# EAGLE design It-s Time, Do (EAGLE 9.6.2)
AUTHOR: Tiago Silva; IGNORE_RENUMBER: TP; SOURCE: github.com/TiagoPaulaSilva/It-s-Time-Do; VERSION: 1.1
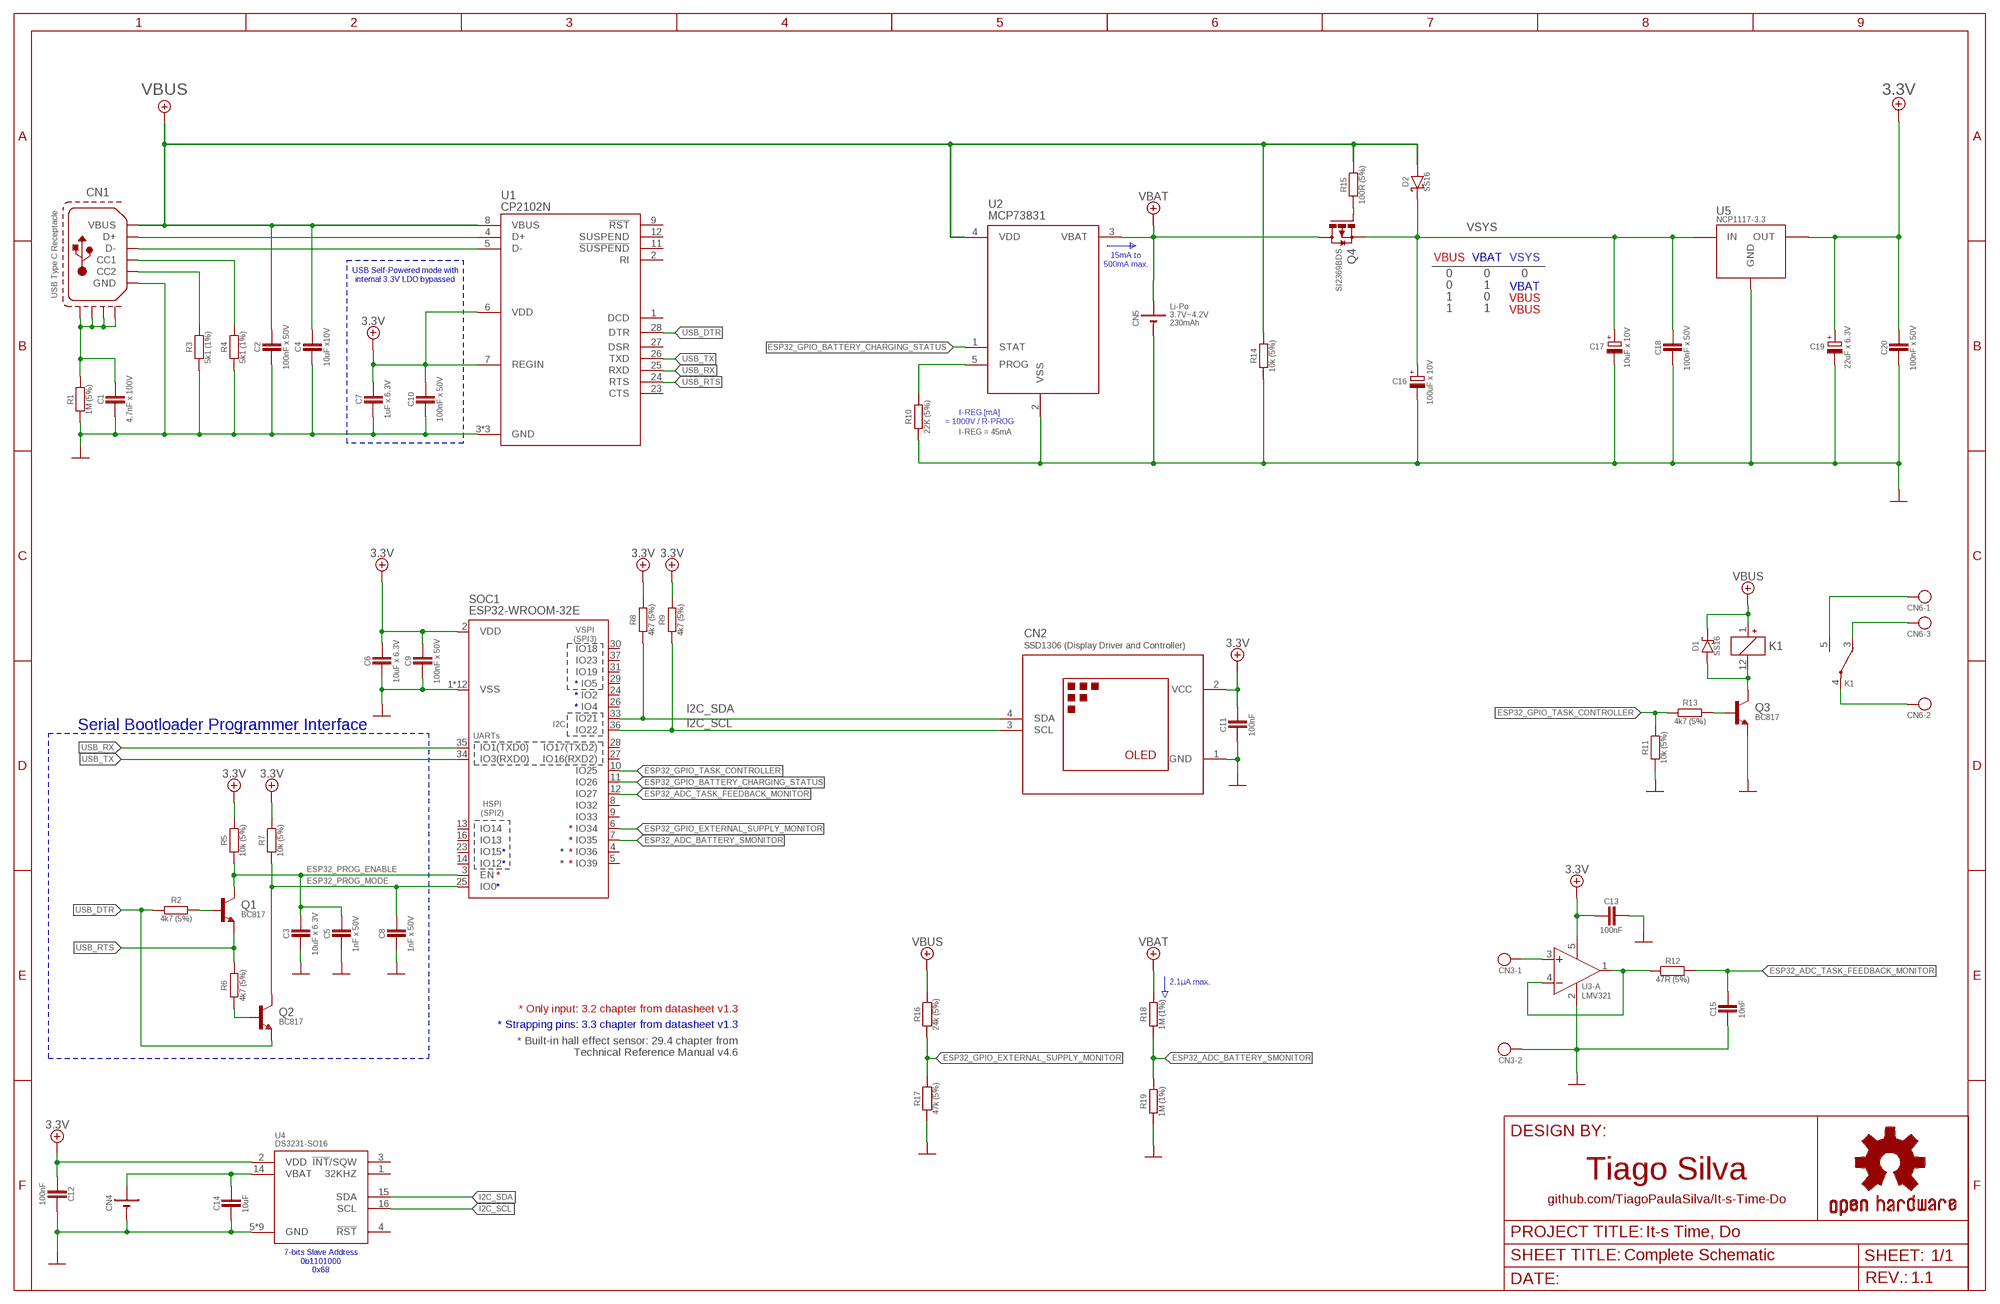
[diagram p0: schematic, sheet 1]

## Parts
C1  4.7nF x 100V  C_0603  [C0603]
C2  100nF x 50V  C_0603  [C0603]
C3  10uF x 6.3V  C_0603  [C0603]
C4  10uF x10V  C_0603  [C0603]
C5  1nF x 50V  C_0603  [C0603]
C6  10uF x 6.3V  C_0603  [C0603]
C7  1uF x 6.3V  C_0603  [C0603]
C8  1nF x 50V  C_0603  [C0603]
C9  100nF x 50V  C_0603  [C0603]
C10  100nF x 50V  C_0603  [C0603]
C11  100nF  C_0603  [C0603]
C12  100nF  C_0603  [C0603]
C13  100nF  C_0603  [C0603]
C14  10uF  C_0603  [C0603]
C15  10nF  C_0603  [C0603]
C16  100uF x 10V  CP_5MM  [PTH-5MM]
C17  10uF x 10V  CP_1206_POL  [C1206_POL]
C18  100nF x 50V  C_0603  [C0603]
C19  22uF x 6.3V  CP_1206_POL  [C1206_POL]
C20  100nF x 50V  C_0603  [C0603]
CN1  USB Type C Receptacle  USB-C-16P-2LAYERS  [USB-C-16P-2LAYER-PADS]
CN2  OLED-MODULE-I2C-SOCKET  [PIN_HEADER_1X4_FEMALE]
CN3  2P-MINI-FIT-JR  [MINI-FIT-JR-2P]
CN4  CR1220  CELL-HARWIN  [CR1220/1225_HOLDER2]
CN5  BATTERY  CELL-JST-PH-2P-H  [JST-PH-2P-H]
CN6  3P-MINI-FIT-JR  [MINI-FIT-JR-3P]
D1  FM4004  SCHOTTKY-SS16  [DO-214AC]
D2  SCHOTTKY-SS16  [DO-214AC]
K1  DPDT-SMD  [EE2-5NU]
Q1  NPN-BC817  [SOT23-3]
Q2  NPN-BC817  [SOT23-3]
Q3  BC817  NPN-BC817  [SOT23-3]
Q4  P-FET-ENHANCEMENT-SI2369BDS  [SOT23-3]
R1  1M (5%)  R_0603  [R0603]
R2  4k7 (5%)  R_0603  [R0603]
R3  5k1 (1%)  R_0603  [R0603]
R4  5k1 (1%)  R_0603  [R0603]
R5  10k (5%)  R_0603  [R0603]
R6  4k7 (5%)  R_0603  [R0603]
R7  10k (5%)  R_0603  [R0603]
R8  4k7 (5%)  R_0603  [R0603]
R9  4k7 (5%)  R_0603  [R0603]
R10  22K (5%)  R_0603  [R0603]
R11  10k (5%)  R_0603  [R0603]
R12  47R (5%)  R_0603  [R0603]
R13  4k7 (5%)  R_0603  [R0603]
R14  10k (5%)  R_0603  [R0603]
R15  100R (5%)  R_0603  [R0603]
R16  24k (5%)  R_0603  [R0603]
R17  47k (5%)  R_0603  [R0603]
R18  1M (1%)  R_0603  [R0603]
R19  1M (1%)  R_0603  [R0603]
SOC1  ESP32-WROOM-32E  ESP32-WROOM-32E-N4  [ESP32-WROOM-32E]
U1  CP2102N  [QFN-28]
U2  MCP73831  MCP73831T-2ACI/OT  [SOT-23-5]
U3  LMV321  SINGLE-LMV321  [SOT-23-5]
U4  DS3231-SO16  [SOIC-16W_(SO16)]
U5  1117-3.3V  [SOT-223-3]

## Nets
0V: C1.1 C2.1 C3.2 C4.1 C5.2 C6.2 C7.1 C8.2 C9.2 C10.1 C11.2 C12.1 C13.1 C14.2 C15.2 C16.2(-) C17.2(-) C18.2 C19.2(-) C20.2 CN1.GND CN1.GND2(GND) CN2.1(GND) CN3.2 CN4.2(-) CN5.2(-) Q3.2(E) R1.2 R3.2 R4.2 R10.1 R11.2 R14.1 R17.2 R19.1 SOC1.1(VSS) SOC1.15(VSS) SOC1.38(VSS) SOC1.E1(VSS) SOC1.E2(VSS) SOC1.E3(VSS) SOC1.E4(VSS) SOC1.E5(VSS) SOC1.E6(VSS) SOC1.E7(VSS) SOC1.E8(VSS) SOC1.E9(VSS) U1.3(GND) U1.EXP(GND) U1.M(GND) U2.2(VSS) U3.2(V-) U4.5(GND) U4.6(GND) U4.7(GND) U4.8(GND) U4.9(GND) U4.10(GND) U4.11(GND) U4.12(GND) U4.13(GND) U5.1(GND)
3.3V: C6.1 C7.2 C9.1 C10.2 C11.1 C12.2 C13.2 C19.1(+) C20.1 CN2.2(VCC) R5.1 R7.1 R8.2 R9.2 SOC1.2(VDD) U1.6(VDD) U1.7(REGIN) U3.5(V+) U4.2(VDD) U5.2(OUT) U5.4(OUT)
ESP32_ADC_BATTERY_SMONITOR: R18.1 R19.2 SOC1.7(IO35)
ESP32_ADC_TASK_FEEDBACK_MONITOR: C15.1 R12.2 SOC1.12(IO27)
ESP32_GPIO_BATTERY_CHARGING_STATUS: SOC1.11(IO26) U2.1(STAT)
ESP32_GPIO_EXTERNAL_SUPPLY_MONITOR: R16.2 R17.1 SOC1.6(IO34)
ESP32_GPIO_TASK_CONTROLLER: R11.1 R13.2 SOC1.10(IO25)
ESP32_PROG_ENABLE: C3.1 C5.1 Q1.3(C) R5.2 SOC1.3(EN)
ESP32_PROG_MODE: C8.1 Q2.3(C) R7.2 SOC1.25(IO0)
I2C_SCL: CN2.3(SCL) R9.1 SOC1.36(IO22) U4.16(SCL)
I2C_SDA: CN2.4(SDA) R8.1 SOC1.33(IO21) U4.15(SDA)
N$1: CN1.B5(CC2) R3.1
N$2: CN1.A5(CC1) R4.1
N$3: CN1.A7(D-) CN1.B7(D-) U1.5(D-)
N$4: CN3.1 U3.3(-A:+IN)
N$5: CN6.1 K1.5(-A:NO)
N$6: CN1.A6(D+) CN1.B6(D+) U1.4(D+)
N$7: Q1.1(B) R2.1
N$8: Q2.1(B) R6.1
N$11: Q4.1(G) R15.2
N$12: R12.1 U3.1(-A:OUT) U3.4(-A:-IN)
N$14: CN6.2 K1.4(-A:COM)
N$15: CN6.3 K1.3(-A:NC)
N$26: R10.2 U2.5(PROG)
N$41: Q3.1(B) R13.1
N$42: D1.2(A) K1.12(K:-) Q3.3(C)
N$79: C1.2 CN1.SHLD1(S1) CN1.SHLD2(S2) CN1.SHLD3(S3) CN1.SHLD4(S4) R1.1
P$1: CN5.1(+) Q4.3(D) R18.2 U2.3(VBAT) ; supply symbol labelled VBAT
RTC_VBAT: C14.1 CN4.1(+) U4.14(VBAT)
USB_DTR: Q2.2(E) R2.2 U1.28(DTR)
USB_RTS: Q1.2(E) R6.2 U1.24(RTS)
USB_RX: SOC1.35(IO1(TXD0)) U1.25(RXD)
USB_TX: SOC1.34(IO3(RXD0)) U1.26(TXD)
VBUS: C2.2 C4.2 CN1.VBUS1(VBUS) CN1.VBUS2(VBUS) D1.1(K) D2.2(A) K1.1(K:+) R14.2 R15.1 R16.1 U1.8(VBUS) U2.4(VDD)
VSYS: C16.1(+) C17.1(+) C18.1 D2.1(K) Q4.2(S) U5.3(IN)
Unconnected: K1.8(-B:NO) K1.9(-B:COM) K1.10(-B:NC) SOC1.4(IO36) SOC1.5(IO39) SOC1.8(IO32) SOC1.9(IO33) SOC1.13(IO14) SOC1.14(IO12) SOC1.16(IO13) SOC1.23(IO15) SOC1.24(IO2) SOC1.26(IO4) SOC1.27(IO16(RXD2)) SOC1.28(IO17(TXD2)) SOC1.29(IO5) SOC1.30(IO18) SOC1.31(IO19) SOC1.37(IO23) U1.1(DCD) U1.2(RI) U1.9(!RST) U1.11(!SUSPEND) U1.12(SUSPEND) U1.23(CTS) U1.27(DSR) U4.1(32KHZ) U4.3(!INT!/SQW) U4.4(!RST!)

## Notes on the sheet
- VBUS | VBAT | VSYS
- 15mA to
  500mA max.
- 0 | 0 | 0
- USB Self-Powered mode with
  internal 3.3V LDO bypassed
- 0 | 1 | VBAT
- 1 | 0 | VBUS
- 1 | 1 | VBUS
- I-REG [mA]
  = 1000V / R-PROG
- I-REG = 45mA
- VSPI
  (SPI3)
- *
- *
- *
- Serial Bootloader Programmer Interface | I2C
- UARTs
- HSPI
  (SPI2)
- *
- *
- * | * | *
- * | * | *
- *
- *
- 2.1μA max.
- * Only input: 3.2 chapter from datasheet v1.3
- * Strapping pins: 3.3 chapter from datasheet v1.3
- * Built-in hall effect sensor: 29.4 chapter from
  Technical Reference Manual v4.6
- 7-bits Slave Address
  0b1101000
  0x68

## Library data of the parts
C1-C10 C15 C18 C20 = My-RLC:C_: NON-POLARIZED CAP
C11-C13 = My-RLC:C_: NON-POLARIZED CAP; PARTNO: *
C14 = My-RLC:C_: NON-POLARIZED CAP; PARTNO: GRJ155R60J106ME11D; PN: GRM188R61A106ME69D
C16 = My-RLC:CP_: POLARIZED CAP; PN: 860040272001
C17 C19 = My-RLC:CP_: POLARIZED CAP; DESCRIPTION: Tantalum Electrolytic Capacitors (Low ESR)
CN1 = My-Connectors:USB-C-16P: USB Type C 16Pin Connector Super Speed pins not available on the 16-pin purely SMD connector so this part is best for USB 2.0 implementations. D1 and D2 are tied together enabling D+/- no matter which way the cable is plugged into the connector. The two channel configuration pins (CC1/2) are exposed. These are normally connected to ground via 5.1k resistors but can be reconfigured for high current/high power applications. **4-LAYER BOARD WARNING!!** If designing 4-layer board, make sure to select the variant _4-LAYER-ISOLATED. The linked footprint (USB-C-16-4LAYER-ISOLATED) includes some very necessary cutout polygons in the inner layers (2 and 15). This prevents the PTH mounting shield legs on the USB connector from electrically connecting any other polygons on the inner layers (usually VCC and GND).; PN: USB4105-GF-A
CN2 = My-Displays:OLED-MODULE-I2C; FAMILY: SSD1306 (Display Driver and Controller)
CN3 = My-Connectors:2P-: KK Plus 396 Header Current - Maximum per Contact 11.0A Voltage - Maximum 350V AC/DC Pitch - Mating Interface 3.96mm Vertical Fully Shrouded; PN: 26-01-3114
CN4 = My-Battery:CELL-; PARTNO: *; PN: S8411-45R
CN5 = My-Battery:CELL-; CAPACITY: 230mAh; TYPE: Li-Po; VOLTAGE: 3.7V~4.2V
CN6 = My-Connectors:3P-; PN: 39-30-3035
D1 = My-Diodes:SCHOTTKY-; FAMILY: SS16; IF: 1A; PN: FM4004W-W; VF: 750mV; VR: 60V
D2 = My-Diodes:SCHOTTKY-; FAMILY: SS16; IF: 1A; PN: SS16; VF: 750mV; VR: 60V
K1 = My-Relays:DPDT
Q1 Q2 = My-Transistors:NPN-: Bipolar Junction Transistor - NPN; FAMILY: BC817; IC: 500mA; PN: BC817-25,215; VCE: 700mV; VCEO: 45V
Q3 = My-Transistors:NPN-: Bipolar Junction Transistor - NPN; FAMILY: BC817; IC: 500mA; PN: BC817K-16HR; VCE: 700mV; VCEO: 45V
Q4 = My-Transistors:P-FET-ENHANCEMENT-: Vds - Drain-Source Breakdown Voltage: 30 V Id - Continuous Drain Current: 24 A Rds On - Drain-Source Resistance: 21 mOhms Vgs - Gate-Source Voltage: - 25 V, + 25 V; FAMILY: SI2369BDS; ID: 7.5 A; PD: 2.5 W; PN: SI2369BDS-T1-GE3; RDS: 27 mOhms; VDS: 30 V; VGS: - 20 V, + 16 V
R1-R9 R12 R14 R15 = My-RLC:R_: RESISTOR
R10 R18 R19 = My-RLC:R_: RESISTOR; PARTNO: *
R11 = My-RLC:R_: RESISTOR; PN: RC0603JR-0710KL
R13 = My-RLC:R_: RESISTOR; PN: RC0603JR-074K7L
R16 = My-RLC:R_: RESISTOR; PARTNO: RC0402FR-0724KL; PN: RC0603JR-0724KL
R17 = My-RLC:R_: RESISTOR; PARTNO: RC0402FR-0747KL; PN: RC0603JR-1047KL
SOC1 = My-SoCs:ESP32-WROOM-32E: Espressif WiFi Module 2.4 GHz Wi­Fi + Bluetooth® + Bluetooth LE module Built around ESP32 series of SoCs, Xtensa® dual­core 32­bit LX6 microprocessor 4/8/16 MB flash available 26 GPIOs, rich set of peripherals On­board PCB antenna or external antenna connector; PN: ESP32-WROOM-32E-N4
U1 = My-ICs:CP2102: Single-Chip USB to UART Bridge; PN: CP2102N-A02-GQFN28
U2 = My-ICs:MCP73831: MCP73831/2 Miniature Single-Cell, Fully Integrated Li-Ion, Li-Polymer Charge Management Controllers. Nice and small simple lipoly charge controller, with adjustable current and status output (LED) http://www.ladyada.net/library/pcb/eaglelibrary.html; PARTNO: *; PN: MCP73831T-2ACI/OT
U3 = My-OpAmps:SINGLE; PN: LMV321RILT
U4 = My-ICs:DS3231: Extremely Accurate I2C-Integrated RTC/TCXO/Crystal; PN: DS3231SN#
U5 = My-LDOs:1117-; DESCRIPTION: Voltage Regulator (LDO); FAMILY: NCP1117-3.3; IOUT: 800 mA; PN: LT1117CST-3.3#PBF; VDROP: 1.1V; VOUT: 3.3V

## Net classes
2 gnd: width 0.152 mm, drill 0.559 mm, clearance 0.254 mm

## Board
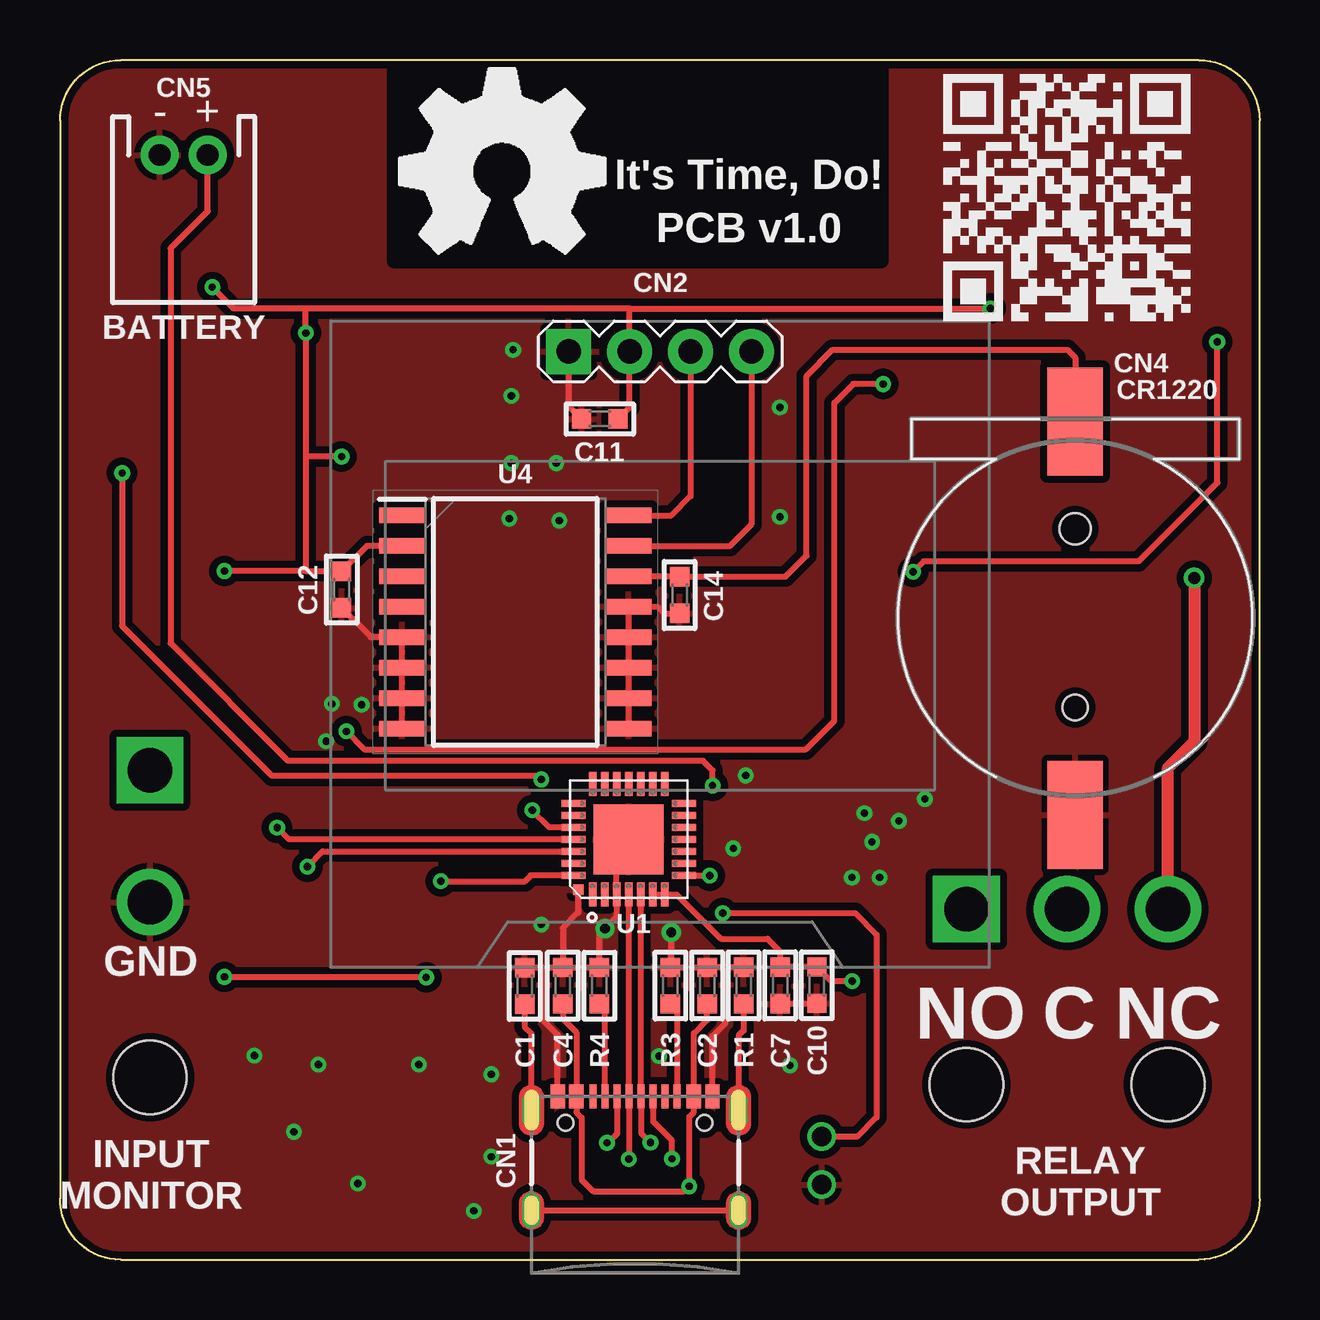
[diagram p1: board, top side]
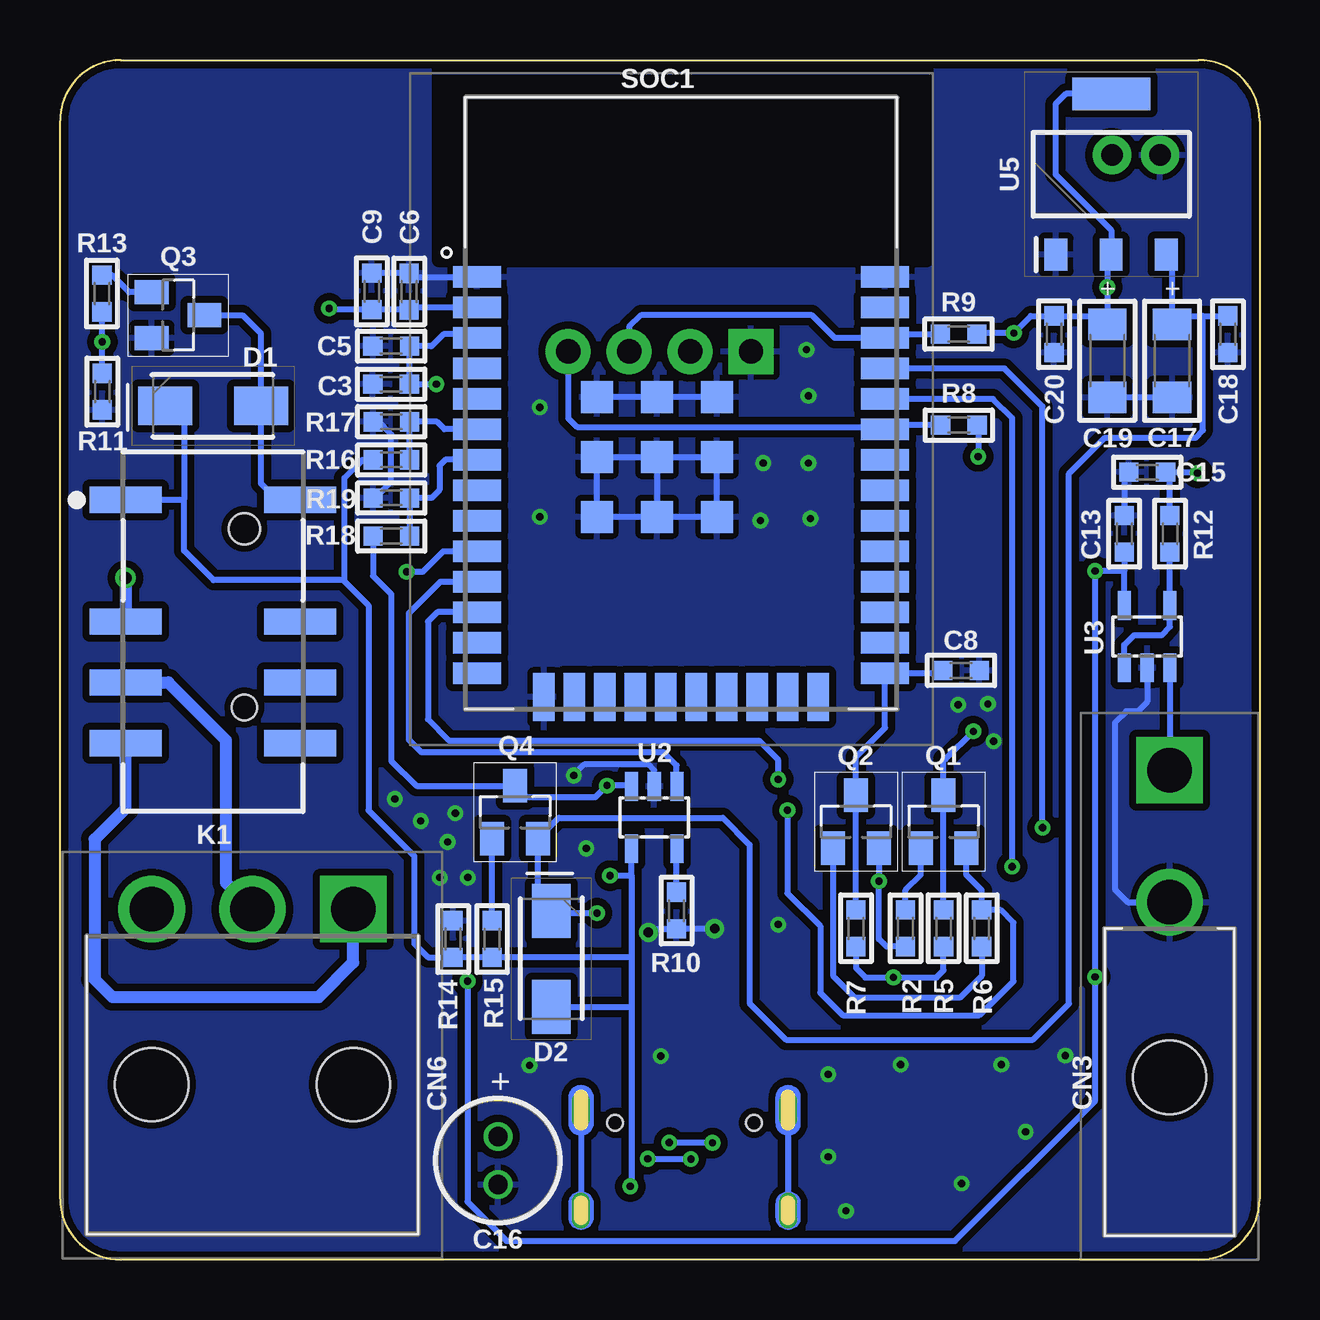
[diagram p2: board, bottom side, seen from below]

Size 50.01 x 50.01 mm. Coordinates in mm from the lower left corner, seen from the top.
Outline: 47.47,50.01 arc-90 50.01,47.47 50.01,2.54 arc-90 47.47,0 2.54,0 arc-90 0,2.54 0,47.47 arc-90 2.54,50.01 47.47,50.01
Copper layers (1*16): Top 0.035mm / dielectric 1.5mm / Bottom 0.035mm
Design rules "SparkFun-2-Layer-General-JLCPCB": minimum track width 7mil, minimum drill 0.3mm, track to track 7mil, track to pad 7mil, pad to pad 7mil, via to via 7mil, smd to smd 7mil, copper to edge 7mil, drill to drill 7mil, minimum pad ring 7mil, minimum via ring 7mil, stop-mask expansion 3mil, vias tented up to drill 25mil, thermal gap 10mil
tKeepout: area 13.9,41.7 to 34.2,50.2
bKeepout: area 13.9,41.7 to 34.2,50.3
tRestrict: area 13.9,41.6 to 34.2,50.2
bRestrict: area 13.9,41.7 to 34.2,50.2

### Footprints (pad centres in the part's own frame; a part is rotated, then mirrored left to right if it is on the bottom)
C0603 = smd 0.8 x 0.8: 1 -0.762,0; 2 0.762,0
PTH-5MM = drill 0.8: 1 1,0; 2 -1,0
C1206_POL = smd 1.3 x 1.6: 1 -1.524,0; 2 1.524,0
USB-C-16P-2LAYER-PADS = smd 0.3 x 1: A5 -1.25,-0.34; A6 -0.25,-0.34; A7 0.25,-0.34; A8 1.25,-0.34; B5 1.75,-0.34; B6 0.75,-0.34; B7 -0.75,-0.34; B8 -1.75,-0.34 | smd 0.6 x 1: GND -3.225,-0.34; GND2 3.225,-0.34; VBUS1 -2.45,-0.34; VBUS2 2.45,-0.34 | drill 0.4 pad 0.6 long: SHLD1 -4.318,-0.915; SHLD2 4.318,-0.915; SHLD3 -4.318,-5.095; SHLD4 4.318,-5.095 | hole 0.65: -2.89,-1.445; 2.89,-1.445
PIN_HEADER_1X4_FEMALE = drill 1.016 pad 1.88 square: 1 0,0 | drill 1.016 pad 1.88: 2 2.54,0; 3 5.08,0; 4 7.62,0
MINI-FIT-JR-2P = drill 1.85 pad 2.775 square: 1 0,9.7 | drill 1.85 pad 2.775: 2 0,4.2 | hole 3.05: 0,-3.1
CR1220/1225_HOLDER2 = smd 2.3 x 4.5: 1 0,-8.2; 2 0,8.2 | hole 1.3: 0,-3.725 | hole 1.05: 0,3.725
JST-PH-2P-H = drill 0.9 pad 1.6: 1 -1,0; 2 1,0
MINI-FIT-JR-3P = drill 1.85 pad 2.775 square: 1 -5.08,5.08 | drill 1.85 pad 2.775: 2 -5.08,0.88; 3 -5.08,-3.32 | hole 3.05: 2.22,-3.32; 2.22,5.08
DO-214AC = smd 2.25 x 1.6: 1 -2,0; 2 2,0
EE2-5NU = smd 1.1 x 3: 1 2,-3.645; 3 7.08,-3.645; 4 9.62,-3.645; 5 12.16,-3.645; 8 12.16,3.645; 9 9.62,3.645; 10 7.08,3.645; 12 2,3.645
SOT23-3 = smd 1 x 1.4: 1 -0.95,-1.1; 2 0.95,-1.1; 3 0,1.1
R0603 = smd 0.8 x 0.8: 1 -0.762,0; 2 0.762,0
ESP32-WROOM-32E = smd 2 x 0.9: 1 -7.62,7.62; 2 -7.62,6.35; 3 -7.62,5.08; 4 -7.62,3.81; 5 -7.62,2.54; 6 -7.62,1.27; 7 -7.62,0; 8 -7.62,-1.27; 9 -7.62,-2.54; 10 -7.62,-3.81; 11 -7.62,-5.08; 12 -7.62,-6.35; 13 -7.62,-7.62; 14 -7.62,-8.89; 25 9.38,-8.89; 26 9.38,-7.62; 27 9.38,-6.35; 28 9.38,-5.08; 29 9.38,-3.81; 30 9.38,-2.54; 31 9.38,-1.27; 32 9.38,0; 33 9.38,1.27; 34 9.38,2.54; 35 9.38,3.81; 36 9.38,5.08; 37 9.38,6.35; 38 9.38,7.62 | smd 0.9 x 2: 15 -4.835,-9.89; 16 -3.565,-9.89; 17 -2.295,-9.89; 18 -1.025,-9.89; 19 0.245,-9.89; 20 1.515,-9.89; 21 2.785,-9.89; 22 4.055,-9.89; 23 5.325,-9.89; 24 6.595,-9.89 | smd 1.33 x 1.33: E1 -2.62,2.62; E2 -0.12,2.62; E3 2.38,2.62; E4 -2.62,0.12; E5 -0.12,0.12; E6 2.38,0.12; E7 -2.62,-2.38; E8 -0.12,-2.38; E9 2.38,-2.38
QFN-28 = smd 1 x 0.3: 1 -2.3,1.5; 2 -2.3,1; 3 -2.3,0.5; 4 -2.3,0; 5 -2.3,-0.5; 6 -2.3,-1; 7 -2.3,-1.5; 15 2.3,-1.5; 16 2.3,-1; 17 2.3,-0.5; 18 2.3,0; 19 2.3,0.5; 20 2.3,1; 21 2.3,1.5 | smd 0.3 x 1: 8 -1.5,-2.3; 9 -1,-2.3; 10 -0.5,-2.3; 11 0,-2.3; 12 0.5,-2.3; 13 1,-2.3; 14 1.5,-2.3; 22 1.5,2.3; 23 1,2.3; 24 0.5,2.3; 25 0,2.3; 26 -0.5,2.3; 27 -1,2.3; 28 -1.5,2.3 | smd 2.921 x 2.921: EXP 0,0 | smd 0.435 x 0.435: M -2.103,2.103
SOT-23-5 = smd 0.55 x 1.2: 1 -0.95,-1.3; 2 0,-1.3; 3 0.95,-1.3; 4 0.95,1.3; 5 -0.95,1.3
SOIC-16W_(SO16) = smd 1.925 x 0.65: 1 -4.712,4.445; 2 -4.712,3.175; 3 -4.712,1.905; 4 -4.712,0.635; 5 -4.712,-0.635; 6 -4.712,-1.905; 7 -4.712,-3.175; 8 -4.712,-4.445; 9 4.712,-4.445; 10 4.712,-3.175; 11 4.712,-1.905; 12 4.712,-0.635; 13 4.712,0.635; 14 4.712,1.905; 15 4.712,3.175; 16 4.712,4.445
SOT-223-3 = smd 1.35 x 0.95: 1 -3.35,2.3; 2 -3.35,0; 3 -3.35,-2.3 | smd 1.35 x 3.25: 4 3.35,0

### Placement (x,y rotation side)
C1  19.37,11.41 270 top
C2  26.98,11.43 270 top
C3  36.2,36.49 180 bottom
C4  20.96,11.42 270 top
C5  36.2,38.08 180 bottom
C6  35.45,40.35 90 bottom
C7  30.02,11.43 90 top
C8  12.45,24.56 0 bottom
C9  37.01,40.36 90 bottom
C10  31.55,11.44 90 top
C11  22.5,35.05 180 top
C12  11.74,27.93 90 top
C13  5.65,30.26 270 bottom
C14  25.83,27.71 270 top
C15  4.69,32.82 180 bottom
C16  31.75,4.13 90 bottom
C17  3.65,37.47 270 bottom
C18  1.33,38.58 270 bottom
C19  6.35,37.47 270 bottom
C20  8.57,38.58 270 bottom
CN1  23.97,7.14 0 top
CN2  21.2,37.85 0 top
CN3  3.76,10.7 0 bottom
CN4  42.32,26.74 180 top
CN5  5.16,46.05 180 top
CN6  42.86,9.53 270 bottom
D1  43.63,35.59 0 bottom
D2  29.53,12.54 270 bottom
K1  43.63,33.68 270 bottom
Q1  13.18,18.26 0 bottom
Q2  16.83,18.26 0 bottom
Q3  45.09,39.37 270 bottom
Q4  31.04,18.65 0 bottom
R1  28.5,11.43 90 top
R2  14.76,13.81 270 bottom
R3  25.44,11.43 90 top
R4  22.48,11.42 90 top
R5  13.18,13.81 90 bottom
R6  11.59,13.81 90 bottom
R7  16.83,13.81 90 bottom
R8  12.54,34.78 0 bottom
R9  12.55,38.58 0 bottom
R10  24.31,14.55 90 bottom
R11  48.24,36.18 270 bottom
R12  3.74,30.26 90 bottom
R13  48.26,40.27 270 bottom
R14  33.62,13.37 270 bottom
R15  32,13.37 90 bottom
R16  36.2,33.34 0 bottom
R17  36.2,34.92 180 bottom
R18  36.2,30.16 180 bottom
R19  36.2,31.75 0 bottom
SOC1  25,33.34 0 bottom
U1  23.7,17.52 90 top
U2  25.24,18.43 180 bottom
U3  4.69,25.97 0 bottom
U4  18.98,26.58 0 top
U5  6.19,45.24 90 bottom

### Tracks (layer width: path | path; a pad name or v marks a point on that pad's centre or on a via)
0V  (via drill 0.3 pad 0.5, 0.4 pad 0.8)
  Top 0.254: U4.9 U4.10 U4.11 U4.12 U4.13 24.92,27.22 25.2,26.94 C14.2 | U4.8 U4.7 U4.6 U4.5 12.97,25.95 C12.1 | U1.EXP 23.2,17.52 U1.3 23.2,14.29 v22.72,13.8 22.48,13.56 R4.2 | CN1.GND2 27.2,9.32 27.73,9.85 27.73,12.19 | 27.73,12.19 C2.1 R3.2 25.48,12.23 v25.48,13.64 | C10.1 31.54,10.67 C7.1 | 20.16,12.17 20.95,12.17 C4.1 | C4.1 R4.2 | R4.2 | CN1.GND 20.75,9.38 20.16,9.96 20.16,12.17 | U1.M 21.6,14.47 20.96,13.82 C4.1 | CN2.1 21.2,35.59 C11.2 | C1.1 20.16,12.17 | R1.2 27.73,12.19
  Bottom 0.254: C15.2 5.64,32.63 C13.1 | U3.2 4.69,23.25 5.08,22.86 5.56,22.86 6.03,22.39 6.03,15.44 5.49,14.9 CN3.2 | C9.2 C6.2 35.3,40.96 SOC1.1 | C17.2 C19.2 | v25.48,13.64 25.33,13.79 R10.1 24.3,13.8 v22.72,13.8 | SOC1.E3 SOC1.E2 SOC1.E1 | SOC1.E5 SOC1.E4 SOC1.E7 SOC1.E8 | SOC1.E5 SOC1.E6 SOC1.E9 SOC1.E8 | SOC1.E5 SOC1.E8 | R19.1 36.88,31.75 36.2,32.43 36.2,34.4 36.73,34.92 R17.2 | U2.2 25.24,20.39 25.48,20.64 28.16,20.64 28.61,20.19
  other vias: 20.07,13.97 17.98,7.72 17.25,2.03 12.42,3.17 9.75,5.33 8.1,8.51 10.77,8.13 14.96,8.13 17.98,4.29 30.43,8.1 24.97,8.48 28.07,17.14 18.89,37.93 18.81,36.01 18.81,33.21 20.69,33.21 20.81,30.81 18.73,30.89 30.01,30.97 30.01,35.53 34.17,15.93 33.01,15.93 33.53,18.61 36.05,19.21 34.97,18.29 33.85,17.41 28.59,20.18 12.57,23.13 11.33,23.17 11.09,21.61
  pour Bottom (isolate 0.305): 0,0 50.16,0 50.16,49.15 50.16,50.04 2.79,50.04 0,50.04
  pour Top (isolate 0.305): 0,0 50.16,0 50.16,49.66 50.16,50.04 5.71,50.04 0,50.04
3.3V  (via drill 0.3 pad 0.5)
  Top 0.254: U1.6 U1.7 25.7,15.22 27.55,13.37 29.49,13.37 30.02,12.84 C7.2 C10.2 32.14,11.61 v33.02,11.61 | 10.25,33.48 v10.25,38.63 10.25,39.65 | 10.25,33.48 10.25,28.7 | 10.25,28.7 C12.2 12.8,29.76 U4.2 | 10.25,28.7 v6.86,28.7 | C11.1 23.74,35.52 CN2.2 23.74,39.65 | 23.74,39.65 10.25,39.65 | 10.25,39.65 7.24,39.65 v6.35,40.54 | v11.73,33.48 10.25,33.48 | 23.74,39.65 v38.79,39.65 | v15.27,11.77 6.88,11.77 v6.86,11.79
  Bottom 0.254: R9.2 11.74,38.63 v10.25,38.63 9.54,39.34 C20.1 6.7,39.34 C19.1 v6.35,40.54 6.35,41.73 U5.2 6.19,42.92 8.51,45.24 8.51,48.16 8.07,48.59 U5.4 | R7.1 16.83,12.16 16.43,11.77 v15.27,11.77 13.47,11.77 13.18,12.06 R5.1 | SOC1.2 35.37,39.69 35.46,39.6 | v38.79,39.65 38.74,39.6 C9.1 35.46,39.6 | U3.5 5.64,28.7 | 5.64,28.7 v6.86,28.7 v6.86,11.79 6.86,6.63 12.7,0.79 31.39,0.79 33.02,2.41 v33.02,11.61 | R8.2 11.73,34.78 v11.73,33.48 | C6.1 35.46,39.6 | C13.2 5.64,28.7
ESP32_ADC_BATTERY_SMONITOR
  Bottom 0.254: R18.1 R19.2 34.52,31.75 34.19,32.08 34.19,33.1 33.94,33.34 SOC1.7
ESP32_ADC_TASK_FEEDBACK_MONITOR  (via drill 0.3 pad 0.5)
  Top 0.254: v2.59,32.79 2.59,26.42 8.84,20.17 19.91,20.17 v20.07,20.02
  Bottom 0.254: R12.2 3.74,32.64 C15.1 2.62,32.82 v2.59,32.79 | v20.07,20.02 20.07,20.83 20.88,21.64 33.78,21.64 34.67,22.53 34.67,26.59 34.27,26.99 SOC1.12
ESP32_GPIO_BATTERY_CHARGING_STATUS
  Bottom 0.254: U2.1 24.3,19.75 24.3,20.61 24.84,21.15 34.94,21.15 35.46,21.67 35.46,26.95 34.15,28.26 SOC1.11
ESP32_GPIO_EXTERNAL_SUPPLY_MONITOR
  Bottom 0.254: R16.2 R17.1 34.29,34.92 33.98,34.61 SOC1.6
ESP32_GPIO_TASK_CONTROLLER  (via drill 0.3 pad 0.5)
  Top 0.254: v48.24,38.25 48.24,32.39 44.96,29.11 35.99,29.11 v35.56,28.68
  Bottom 0.254: R11.1 v48.24,38.25 48.24,39.51 R13.2 | v35.56,28.68 34.87,28.68 34.02,29.53 SOC1.10
ESP32_PROG_ENABLE  (via drill 0.3 pad 0.5)
  Top 0.254: v34.31,36.5 33.07,36.5 32.28,35.71 32.28,22.46 31.09,21.27 12.69,21.27 v11.94,22.02
  Bottom 0.254: SOC1.3 32.77,38.58 34.03,38.58 34.52,38.08 C5.1 C3.1 v34.33,36.49 v34.31,36.5 | R5.2 Q1.3 13.18,20.86 13.1,20.86 v11.94,22.02
ESP32_PROG_MODE
  Bottom 0.254: R7.2 Q2.3 16.83,20.96 15.62,22.16 SOC1.25 13.32,24.45 C8.1
I2C_SCL
  Top 0.254: U4.16 25.49,31.03 26.28,31.82 CN2.3
  Bottom 0.254: CN2.3 26.28,38.88 25.8,39.37 18.66,39.37 17.71,38.42 SOC1.36 15.46,38.58 R9.1
I2C_SDA
  Top 0.254: U4.15 27.93,29.76 28.82,30.65 CN2.4
  Bottom 0.254: R8.1 15.45,34.78 SOC1.33 15.72,34.71 28.45,34.71 28.81,35.07 CN2.4
N$1
  Top 0.254: CN1.B5 25.72,10.38 R3.1
N$2
  Top 0.254: CN1.A5 22.72,10.42 R4.1
N$3  (via drill 0.3 pad 0.5)
  Top 0.254: CN1.B7 23.22,5.25 22.82,4.85 v22.81,4.87 | v24.61,4.88 24.22,5.27 CN1.A7 24.2,6.82 U1.5
  Bottom 0.254: v24.61,4.88 22.82,4.88 v22.81,4.87
N$4
  Bottom 0.254: U3.3 3.74,20.41 CN3.1
N$5
  Bottom 0.508: CN6.1 37.78,12.38 39.21,10.95 47.83,10.95 48.56,11.68 48.56,17.52 47.28,18.8 K1.5
N$6  (via drill 0.3 pad 0.5)
  Top 0.254: v23.71,4.19 v23.72,4.2 CN1.A6 23.7,6.82 U1.4 | v25.51,4.2 25.51,4.97 24.72,5.76 CN1.B6
  Bottom 0.254: v23.71,4.19 v25.5,4.19 v25.51,4.2
N$7
  Bottom 0.254: R2.1 14.76,15.41 14.13,16.05 Q1.1
N$8
  Bottom 0.254: R6.1 11.59,11.83 12.5,10.92 16.87,10.92 17.78,11.83 Q2.1
N$11
  Bottom 0.254: R15.2 Q4.1
N$12
  Bottom 0.254: U3.1 5.64,25.62 5.23,26.04 4.09,26.04 3.74,26.38 U3.4 R12.1
N$14
  Bottom 0.508: CN6.2 43.09,15.72 43.09,21.66 45.49,24.06 K1.4
N$15  (via drill 0.5)
  Top 0.508: v47.28,28.42 47.28,21.59 46.18,20.5 CN6.3
  Bottom 0.508: v47.28,28.42 | v47.28,28.42 K1.3
N$26
  Bottom 0.254: R10.2 24.31,17.11 U2.5
N$41
  Bottom 0.254: Q3.1 47.12,40.32 47.84,41.03 R13.1
N$42
  Bottom 0.254: K1.12 40.95,31.68 41.63,32.35 D1.2 41.63,38.6 42.4,39.37 Q3.3
N$79
  Top 0.254: CN1.SHLD3 CN1.SHLD4 | R1.1 28.5,9.55 28.29,9.35 CN1.SHLD2 | C1.2 19.37,9.71 19.65,9.43 CN1.SHLD1
  Bottom 0.254: CN1.SHLD1 CN1.SHLD3 | CN1.SHLD2 CN1.SHLD4
P$1  (via drill 0.3 pad 0.5)
  Top 0.254: v27.2,19.76 27.2,20.4 26.8,20.8 9.51,20.8 4.61,25.7 4.61,42.16 6.16,43.71 CN5.1
  Bottom 0.254: U2.3 26.22,19.76 v27.2,19.76 27.68,19.28 30.57,19.28 Q4.3 35.15,19.75 36.2,20.8 36.2,27.74 36.96,28.5 R18.2
RTC_VBAT
  Top 0.254: U4.14 23.71,28.47 C14.1 30.23,28.47 31.11,29.35 31.11,36.84 32.21,37.93 41.99,37.93 42.32,37.6 CN4.1
USB_DTR  (via drill 0.3 pad 0.5)
  Top 0.254: U1.28 19.63,16.02 19.39,15.77 v15.88,15.77
  Bottom 0.254: R2.2 15.56,13.05 15.88,13.37 v15.88,15.77 v15.88,15.78 Q2.2
USB_RTS  (via drill 0.3 pad 0.5)
  Top 0.254: U1.24 20.4,18.02 v19.68,18.73
  Bottom 0.254: v19.68,18.73 19.68,15.27 18.31,13.9 18.31,11.12 17.37,10.19 11.68,10.19 10.26,11.61 10.26,14.05 10.79,14.57 R6.2 11.59,15.4 12.23,16.04 Q1.2
USB_RX  (via drill 0.3 pad 0.5)
  Top 0.254: v9.05,18.01 9.54,17.52 U1.25
  Bottom 0.254: v9.05,18.01 9.05,35.56 10.64,37.15 SOC1.35
USB_TX  (via drill 0.3 pad 0.5)
  Top 0.254: v10.31,16.38 10.96,17.02 U1.26
  Bottom 0.254: v10.31,16.38 v10.32,16.38 10.32,35.08 11.12,35.88 SOC1.34
VBUS  (via drill 0.3 pad 0.5)
  Top 0.254: C4.2 20.96,10.03 21.52,9.47 CN1.VBUS1 21.52,6.15 21.75,5.92 21.75,3.33 22.23,2.86 26.04,2.86 v26.23,3.05 26.23,5.96 26.42,6.15 CN1.VBUS2 26.42,9.44 26.98,9.99 C2.2 | v27.08,16.01 27.07,16.02 U1.8
  Bottom 0.254: 26.19,12.6 26.19,16.03 26.21,16.01 | 26.19,12.6 26.19,10.48 | 26.19,10.48 26.19,3.1 v26.23,3.05 | 26.19,12.6 R15.1 R14.2 | v27.08,16.01 26.21,16.01 | 44.83,31.68 44.83,29.55 43.61,28.33 38.21,28.33 | 38.21,28.33 37.15,27.27 37.15,18.73 35.24,16.83 35.24,13.18 34.67,12.6 R14.2 | K1.1 44.83,31.68 | 44.83,31.68 44.83,35.59 D1.1 | D2.2 26.25,10.54 26.19,10.48 | R14.2 | R16.1 37.4,33.34 38.16,32.58 38.16,28.33 38.21,28.33 | U2.4 26.21,17.11 26.21,16.01
VSYS  (via drill 0.3 pad 0.5)
  Top 0.254: v27.62,14.45 33.15,14.45 34.04,13.56 34.04,5.93 33.24,5.13 C16.1
  Bottom 0.254: v27.62,14.45 29.43,14.45 D2.1 30.09,15.1 Q4.2 29.22,18.41 22.38,18.41 21.26,17.3 21.26,10.69 19.74,9.17 9.45,9.17 7.95,10.67 7.95,32.77 6.45,34.27 2.67,34.27 2.36,34.57 2.36,39.34 | U5.3 3.65,41.65 C17.1 3.3,39.34 2.36,39.34 | 2.36,39.34 C18.1

### Text on the board
tPlace: It's Time, Do! | PCB v1.0 | GND | NO | C | NC | INPUT / MONITOR | RELAY / OUTPUT